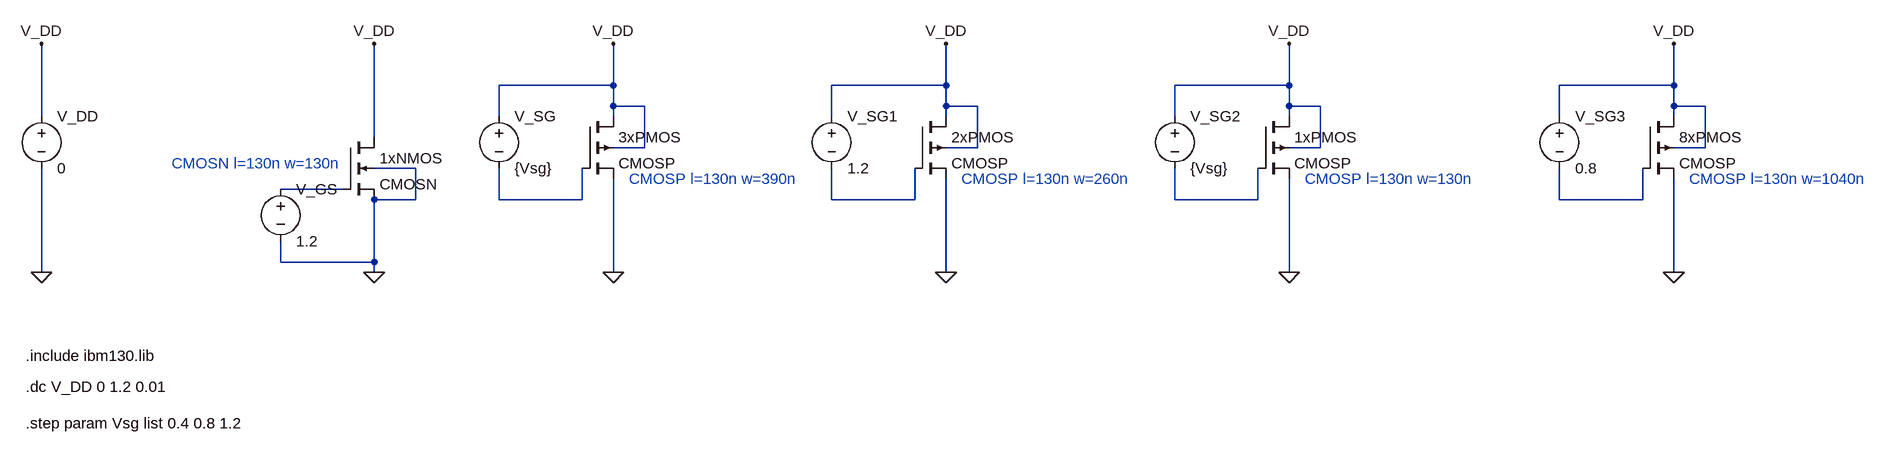
[diagram p0: schematic sim3.1.asc]
sim3.1.asc, the LTspice schematic file:
Version 4
SHEET 1 2392 760
WIRE 464 224 464 160
WIRE 464 224 288 224
WIRE 976 224 976 160
WIRE 976 224 800 224
WIRE 1504 224 1504 160
WIRE 1504 224 1328 224
WIRE 2096 224 2096 160
WIRE 2096 224 1920 224
WIRE 464 256 464 224
WIRE 512 256 464 256
WIRE 976 256 976 224
WIRE 1024 256 976 256
WIRE 1504 256 1504 224
WIRE 1552 256 1504 256
WIRE 2096 256 2096 224
WIRE 2144 256 2096 256
WIRE -416 272 -416 160
WIRE 288 272 288 224
WIRE 464 272 464 256
WIRE 800 272 800 224
WIRE 976 272 976 256
WIRE 1328 272 1328 224
WIRE 1504 272 1504 256
WIRE 1920 272 1920 224
WIRE 2096 272 2096 256
WIRE 96 304 96 160
WIRE 512 320 512 256
WIRE 512 320 464 320
WIRE 1024 320 1024 256
WIRE 1024 320 976 320
WIRE 1552 320 1552 256
WIRE 1552 320 1504 320
WIRE 2144 320 2144 256
WIRE 2144 320 2096 320
WIRE 160 352 96 352
WIRE 48 384 -48 384
WIRE 160 400 160 352
WIRE 160 400 96 400
WIRE 288 400 288 352
WIRE 416 400 416 352
WIRE 416 400 288 400
WIRE 800 400 800 352
WIRE 928 400 928 352
WIRE 928 400 800 400
WIRE 1328 400 1328 352
WIRE 1456 400 1456 352
WIRE 1456 400 1328 400
WIRE 1920 400 1920 352
WIRE 2048 400 2048 352
WIRE 2048 400 1920 400
WIRE -48 496 -48 464
WIRE 96 496 96 400
WIRE 96 496 -48 496
WIRE -416 512 -416 352
WIRE 96 512 96 496
WIRE 464 512 464 368
WIRE 976 512 976 368
WIRE 1504 512 1504 368
WIRE 2096 512 2096 368
FLAG 464 512 0
FLAG 96 512 0
FLAG 464 160 V_DD
FLAG 96 160 V_DD
FLAG -416 512 0
FLAG -416 160 V_DD
FLAG 976 512 0
FLAG 976 160 V_DD
FLAG 1504 512 0
FLAG 1504 160 V_DD
FLAG 2096 512 0
FLAG 2096 160 V_DD
SYMBOL CMOSP 416 272 R0
SYMATTR InstName 3xPMOS
SYMATTR Value2 l=130n w=390n
SYMBOL voltage -416 256 R0
SYMATTR InstName V_DD
SYMATTR Value 0
SYMBOL voltage 288 256 R0
SYMATTR InstName V_SG
SYMATTR Value {Vsg}
SYMBOL CMOSN 48 304 R0
SYMATTR InstName 1xNMOS
SYMATTR Value2 l=130n w=130n
SYMBOL voltage -48 368 R0
SYMATTR InstName V_GS
SYMATTR Value 1.2
SYMBOL CMOSP 928 272 R0
SYMATTR InstName 2xPMOS
SYMATTR Value2 l=130n w=260n
SYMBOL voltage 800 256 R0
SYMATTR InstName V_SG1
SYMATTR Value 1.2
SYMBOL CMOSP 1456 272 R0
SYMATTR InstName 1xPMOS
SYMATTR Value2 l=130n w=130n
SYMBOL voltage 1328 256 R0
SYMATTR InstName V_SG2
SYMATTR Value {Vsg}
SYMBOL CMOSP 2048 272 R0
SYMATTR InstName 8xPMOS
SYMATTR Value2 l=130n w=1040n
SYMBOL voltage 1920 256 R0
SYMATTR InstName V_SG3
SYMATTR Value 0.8
TEXT -440 640 Left 2 !.include ibm130.lib
TEXT -440 688 Left 2 !.dc V_DD 0 1.2 0.01
TEXT -440 744 Left 2 !.step param Vsg list 0.4 0.8 1.2
TEXT 488 368 Left 2 ;CMOSP l=130n w=390n
TEXT -216 344 Left 2 ;CMOSN l=130n w=130n
TEXT 1000 368 Left 2 ;CMOSP l=130n w=260n
TEXT 1528 368 Left 2 ;CMOSP l=130n w=130n
TEXT 2120 368 Left 2 ;CMOSP l=130n w=1040n

The netlist it stands for:
* sim3.1.asc
M§3xPMOS V_DD N002 0 V_DD CMOSP l=130n w=390n
V_DD V_DD 0 0
V_SG V_DD N002 {Vsg}
M§1xNMOS V_DD N001 0 0 CMOSN l=130n w=130n
V_GS N001 0 1.2
M§2xPMOS V_DD N003 0 V_DD CMOSP l=130n w=260n
V_SG1 V_DD N003 1.2
M§1xPMOS V_DD N004 0 V_DD CMOSP l=130n w=130n
V_SG2 V_DD N004 {Vsg}
M§8xPMOS V_DD N005 0 V_DD CMOSP l=130n w=1040n
V_SG3 V_DD N005 0.8
.model NMOS NMOS
.model PMOS PMOS
.lib standard.mos
.include ibm130.lib
.dc V_DD 0 1.2 0.01
.step param Vsg list 0.4 0.8 1.2
* CMOSP l=130n w=390n
* CMOSN l=130n w=130n
* CMOSP l=130n w=260n
* CMOSP l=130n w=130n
* CMOSP l=130n w=1040n
.backanno
.end